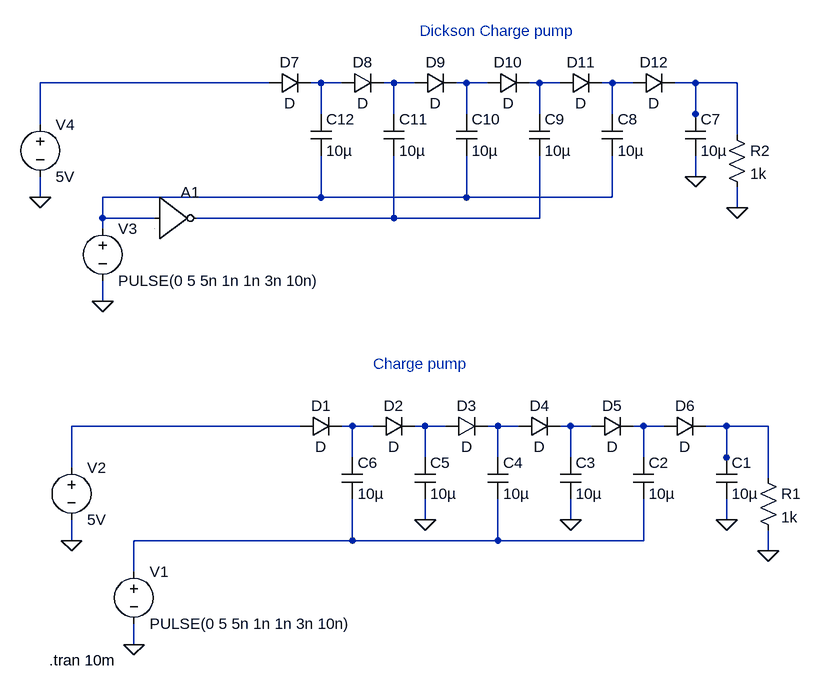
[diagram p0: schematic Charge Pump Debugging.asc]
Charge Pump Debugging.asc, the LTspice schematic file:
Version 4
SHEET 1 880 680
WIRE -128 -432 -480 -432
WIRE -48 -432 -64 -432
WIRE -16 -432 -48 -432
WIRE 64 -432 48 -432
WIRE 96 -432 64 -432
WIRE 176 -432 160 -432
WIRE 208 -432 176 -432
WIRE 288 -432 272 -432
WIRE 320 -432 288 -432
WIRE 400 -432 384 -432
WIRE 432 -432 400 -432
WIRE 528 -432 496 -432
WIRE 592 -432 528 -432
WIRE -48 -384 -48 -432
WIRE 64 -384 64 -432
WIRE 176 -384 176 -432
WIRE 288 -384 288 -432
WIRE 400 -384 400 -432
WIRE 528 -384 528 -432
WIRE -480 -368 -480 -432
WIRE 528 -368 528 -384
WIRE 592 -352 592 -432
WIRE 528 -288 528 -320
WIRE -480 -256 -480 -288
WIRE -48 -256 -48 -320
WIRE -48 -256 -384 -256
WIRE 176 -256 176 -320
WIRE 176 -256 -48 -256
WIRE 400 -256 400 -320
WIRE 400 -256 176 -256
WIRE 592 -240 592 -272
WIRE -384 -224 -384 -256
WIRE -304 -224 -384 -224
WIRE 64 -224 64 -320
WIRE 64 -224 -240 -224
WIRE 288 -224 288 -320
WIRE 288 -224 64 -224
WIRE -384 -208 -384 -224
WIRE -384 -96 -384 -128
WIRE -80 96 -432 96
WIRE 0 96 -16 96
WIRE 32 96 0 96
WIRE 112 96 96 96
WIRE 144 96 112 96
WIRE 224 96 208 96
WIRE 256 96 224 96
WIRE 336 96 320 96
WIRE 368 96 336 96
WIRE 448 96 432 96
WIRE 480 96 448 96
WIRE 576 96 544 96
WIRE 640 96 576 96
WIRE 0 144 0 96
WIRE 112 144 112 96
WIRE 224 144 224 96
WIRE 336 144 336 96
WIRE 448 144 448 96
WIRE 576 144 576 96
WIRE -432 160 -432 96
WIRE 576 160 576 144
WIRE 640 176 640 96
WIRE 112 240 112 208
WIRE 336 240 336 208
WIRE 576 240 576 208
WIRE -432 272 -432 240
WIRE 0 272 0 208
WIRE 0 272 -336 272
WIRE 224 272 224 208
WIRE 224 272 0 272
WIRE 448 272 448 208
WIRE 448 272 224 272
WIRE 640 288 640 256
WIRE -336 320 -336 272
WIRE -336 432 -336 400
FLAG 640 288 0
FLAG 576 240 0
FLAG -336 432 0
FLAG 112 240 0
FLAG 336 240 0
FLAG -432 272 0
FLAG 592 -240 0
FLAG 528 -288 0
FLAG -384 -96 0
FLAG -480 -256 0
SYMBOL diode -80 112 R270
WINDOW 0 32 32 VTop 2
WINDOW 3 0 32 VBottom 2
SYMATTR InstName D1
SYMBOL diode 32 112 R270
WINDOW 0 32 32 VTop 2
WINDOW 3 0 32 VBottom 2
SYMATTR InstName D2
SYMBOL diode 144 112 R270
WINDOW 0 32 32 VTop 2
WINDOW 3 0 32 VBottom 2
SYMATTR InstName D3
SYMBOL diode 256 112 R270
WINDOW 0 32 32 VTop 2
WINDOW 3 0 32 VBottom 2
SYMATTR InstName D4
SYMBOL diode 368 112 R270
WINDOW 0 32 32 VTop 2
WINDOW 3 0 32 VBottom 2
SYMATTR InstName D5
SYMBOL diode 480 112 R270
WINDOW 0 32 32 VTop 2
WINDOW 3 0 32 VBottom 2
SYMATTR InstName D6
SYMBOL res 624 160 R0
SYMATTR InstName R1
SYMATTR Value 1k
SYMBOL cap 560 144 R0
SYMATTR InstName C1
SYMATTR Value 10µ
SYMBOL cap 432 144 R0
SYMATTR InstName C2
SYMATTR Value 10µ
SYMBOL cap 320 144 R0
SYMATTR InstName C3
SYMATTR Value 10µ
SYMBOL cap 208 144 R0
SYMATTR InstName C4
SYMATTR Value 10µ
SYMBOL cap 96 144 R0
SYMATTR InstName C5
SYMATTR Value 10µ
SYMBOL cap -16 144 R0
SYMATTR InstName C6
SYMATTR Value 10µ
SYMBOL voltage -336 304 R0
WINDOW 123 0 0 Left 0
WINDOW 39 0 0 Left 0
SYMATTR InstName V1
SYMATTR Value PULSE(0 5 5n 1n 1n 3n 10n)
SYMBOL voltage -432 144 R0
SYMATTR InstName V2
SYMATTR Value 5V
SYMBOL diode -128 -416 R270
WINDOW 0 32 32 VTop 2
WINDOW 3 0 32 VBottom 2
SYMATTR InstName D7
SYMBOL diode -16 -416 R270
WINDOW 0 32 32 VTop 2
WINDOW 3 0 32 VBottom 2
SYMATTR InstName D8
SYMBOL diode 96 -416 R270
WINDOW 0 32 32 VTop 2
WINDOW 3 0 32 VBottom 2
SYMATTR InstName D9
SYMBOL diode 208 -416 R270
WINDOW 0 32 32 VTop 2
WINDOW 3 0 32 VBottom 2
SYMATTR InstName D10
SYMBOL diode 320 -416 R270
WINDOW 0 32 32 VTop 2
WINDOW 3 0 32 VBottom 2
SYMATTR InstName D11
SYMBOL diode 432 -416 R270
WINDOW 0 32 32 VTop 2
WINDOW 3 0 32 VBottom 2
SYMATTR InstName D12
SYMBOL res 576 -368 R0
SYMATTR InstName R2
SYMATTR Value 1k
SYMBOL cap 512 -384 R0
SYMATTR InstName C7
SYMATTR Value 10µ
SYMBOL cap 384 -384 R0
SYMATTR InstName C8
SYMATTR Value 10µ
SYMBOL cap 272 -384 R0
SYMATTR InstName C9
SYMATTR Value 10µ
SYMBOL cap 160 -384 R0
SYMATTR InstName C10
SYMATTR Value 10µ
SYMBOL cap 48 -384 R0
SYMATTR InstName C11
SYMATTR Value 10µ
SYMBOL cap -64 -384 R0
SYMATTR InstName C12
SYMATTR Value 10µ
SYMBOL voltage -384 -224 R0
WINDOW 123 0 0 Left 0
WINDOW 39 0 0 Left 0
SYMATTR InstName V3
SYMATTR Value PULSE(0 5 5n 1n 1n 3n 10n)
SYMBOL voltage -480 -384 R0
SYMATTR InstName V4
SYMATTR Value 5V
SYMBOL Digital\\inv -304 -288 R0
SYMATTR InstName A1
TEXT 32 0 Left 2 ;Charge pump
TEXT -466 456 Left 2 !.tran 10m
TEXT 104 -512 Left 2 ;Dickson Charge pump

The netlist it stands for:
* Charge Pump Debugging.asc
D1 N010 N011 D
D2 N011 N012 D
D3 N012 N013 D
D4 N013 N014 D
D5 N014 N015 D
D6 N015 N016 D
R1 N016 0 1k
C1 N016 0 10µ
C2 N015 N017 10µ
C3 N014 0 10µ
C4 N013 N017 10µ
C5 N012 0 10µ
C6 N011 N017 10µ
V1 N017 0 PULSE(0 5 5n 1n 1n 3n 10n)
V2 N010 0 5V
D7 N001 N002 D
D8 N002 N003 D
D9 N003 N004 D
D10 N004 N005 D
D11 N005 N006 D
D12 N006 N007 D
R2 N007 0 1k
C7 N007 0 10µ
C8 N006 N008 10µ
C9 N005 N009 10µ
C10 N004 N008 10µ
C11 N003 N009 10µ
C12 N002 N008 10µ
V3 N008 0 PULSE(0 5 5n 1n 1n 3n 10n)
V4 N001 0 5V
A1 N008 0 0 0 0 N009 0 0 BUF
.model D D
.lib standard.dio
* Charge pump
.tran 10m
* Dickson Charge pump
.backanno
.end